# EasyEDA schematic SCH_Single-Sprayer_TH_2025-12-06.json
TITLE: Sheet_1; REV: 1.0; Date: 2025-02-28; Sheet: 1/1; Drawn By: rayjorgensen; Company: Your Company
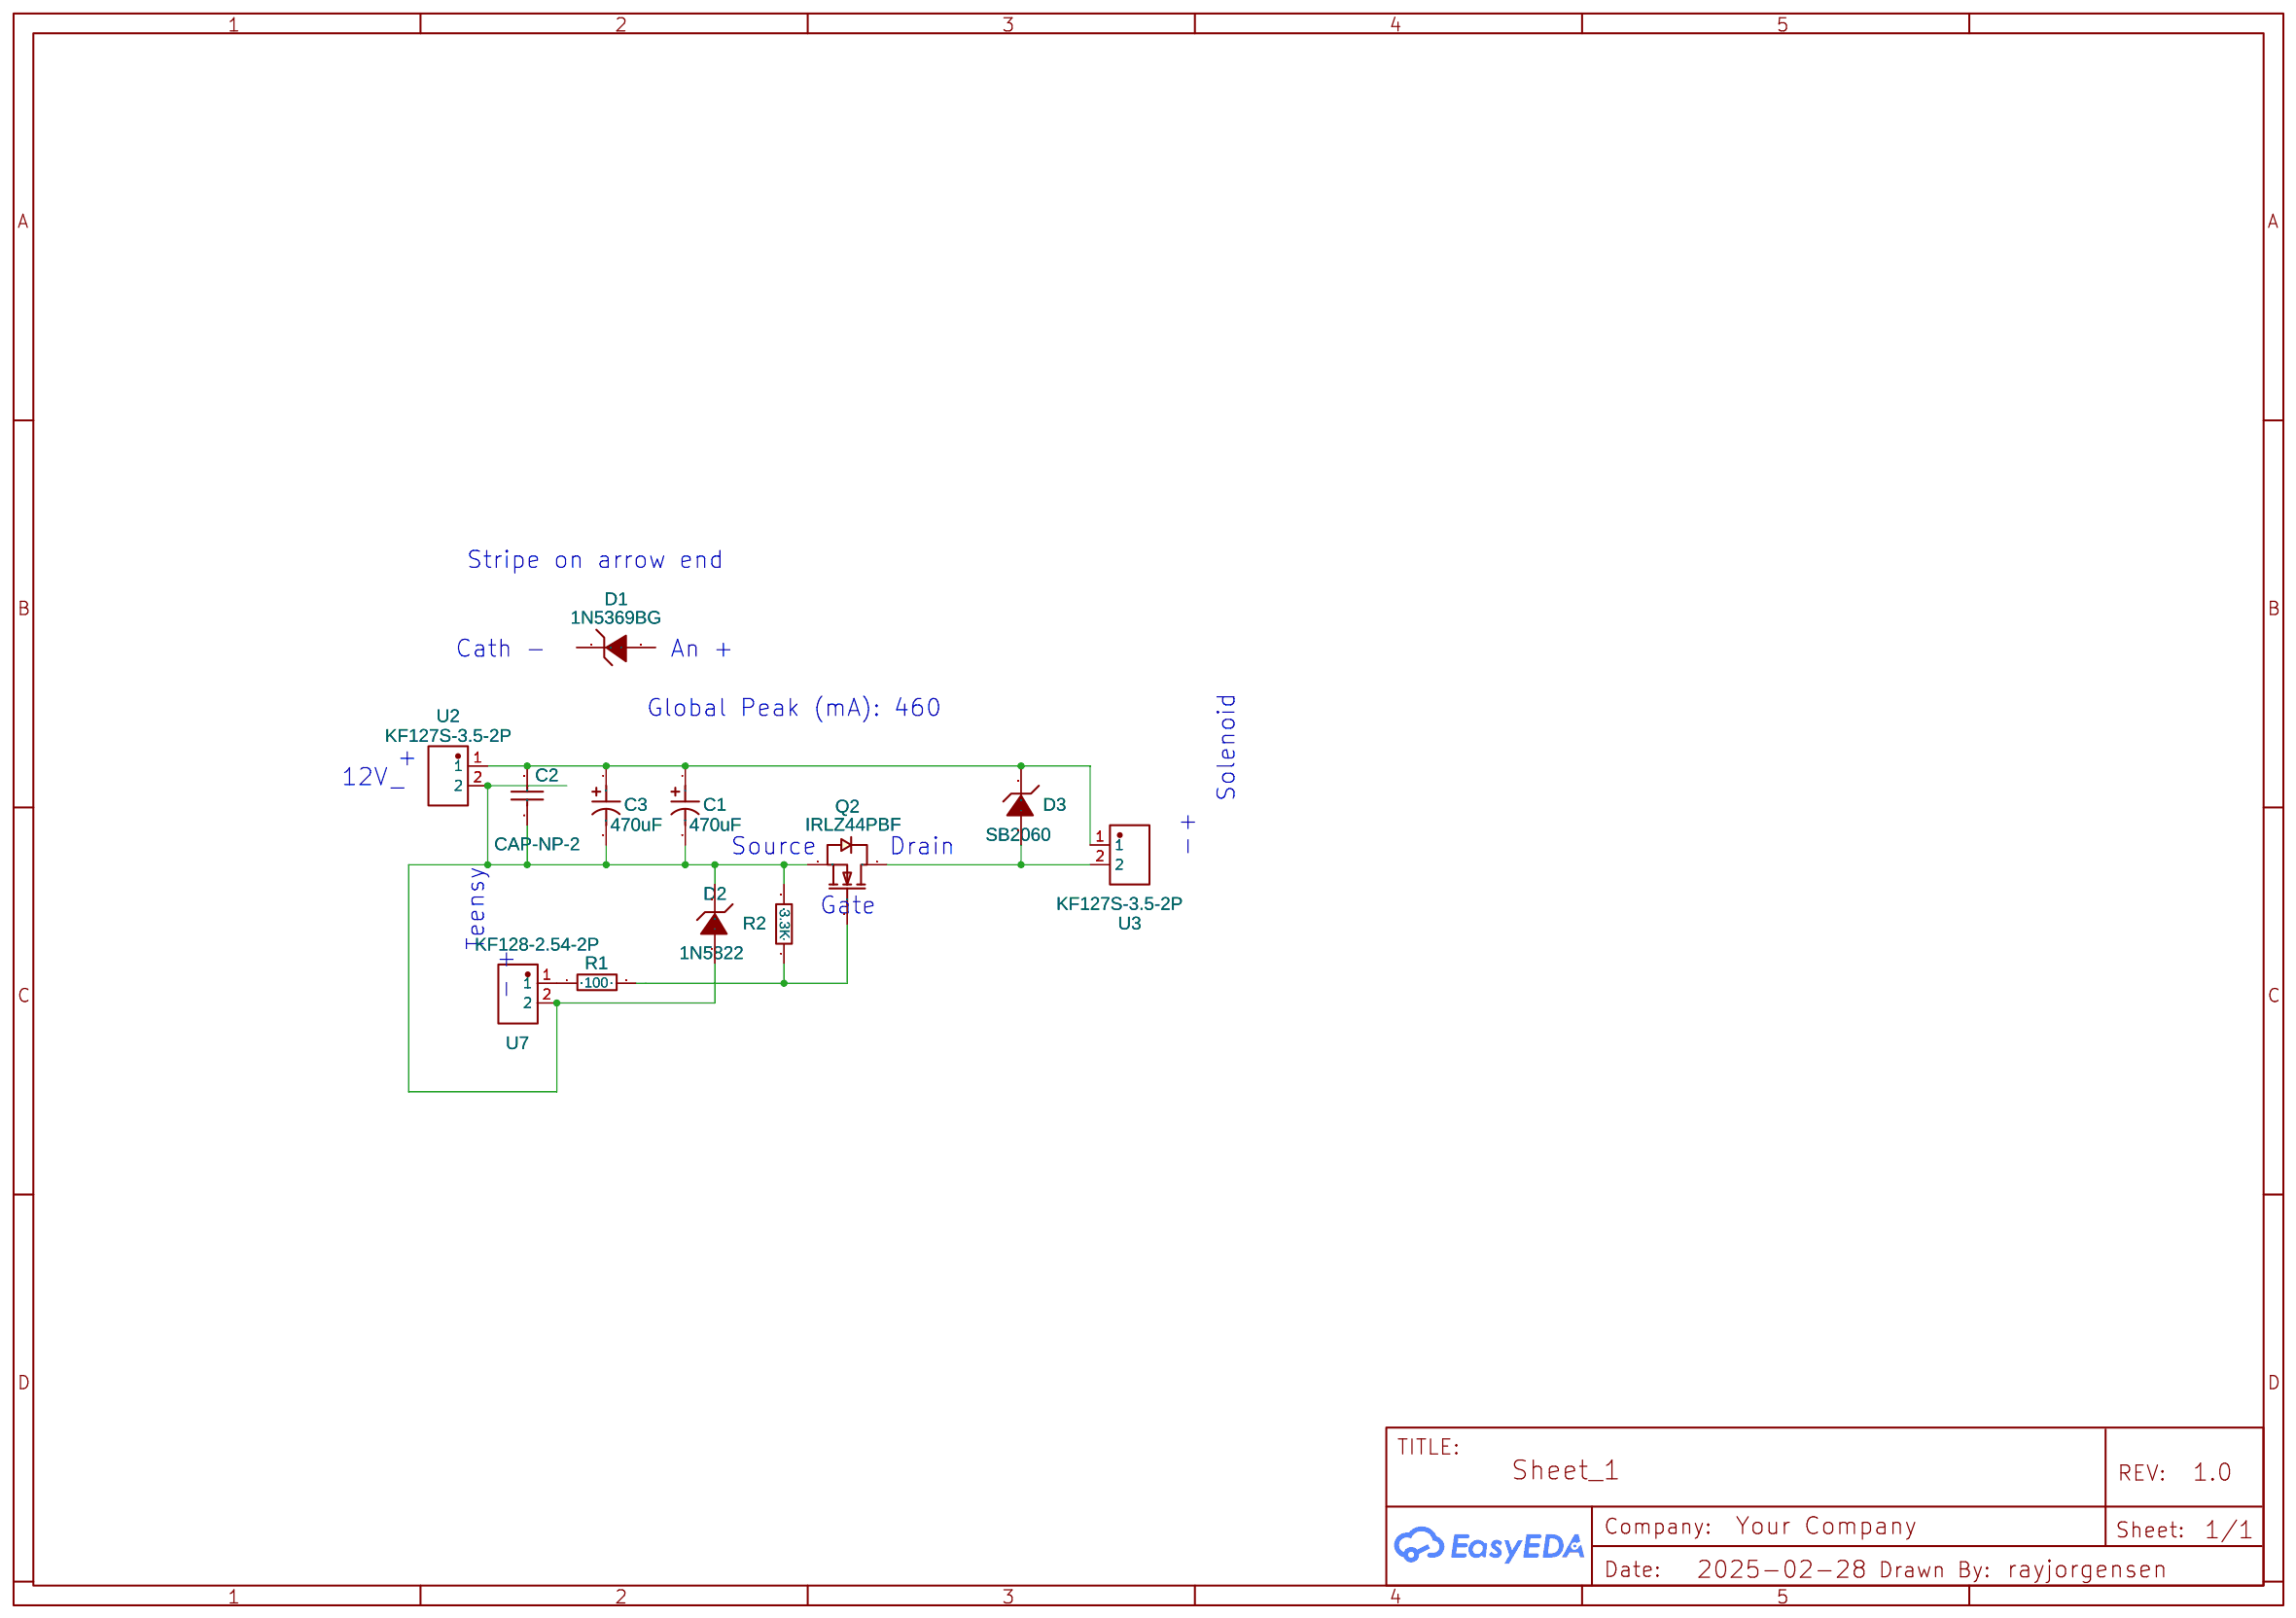
[diagram p0: schematic sheet]

## Parts
C1  470uF  [CAP-TH_BD12.5-P5.00-D0.8-FD]
C2  CAP-NP-2  [VISH-K104K15X7RF5TL2]
C3  470uF  [CAP-TH_BD12.5-P5.00-D0.8-FD]
D1  1N5369BG  [DO-14_BD3.6-L9.0-P12.00-D1.2-RD]
D2  1N5822  [DO-14_BD3.6-L9.0-P12.00-D1.2-RD]
D3  SB2060  [DO-14_BD3.6-L9.0-P12.00-D1.2-RD]
Q2  IRLZ44PBF  [TO-220-3_L10.0-W4.5-P2.54-L]
R1  100  [RES-TH_BD2.5-L6.5-P10.50-D0.6]
R2  3.3K  [RES-TH_BD2.5-L6.5-P10.50-D0.6]
U2  KF127S-3.5-2P  [CONN-TH_2P-P3.50_KEFA_KF127S-3.5-2P]
U3  KF127S-3.5-2P  [CONN-TH_2P-P3.50_KEFA_KF127S-3.5-2P]
U7  KF128-2.54-2P  [CONN-TH_P2.54_KF128-2.54-2P]

## Library data of the parts
C1 C3 = UHE1E102MHD6TO: Supplier: LCSC; Supplier Part: C1588747; Manufacturer: Nichicon(尼吉康); JLCPCB Part Class: Extended Part; Contributor: lcsc
C2 = CAP-NP-2: Size / Dimension: 0.157"Lx0.098"W(4.00mmx2.50mm); Manufacturer: Vishay; Operating Temperature: -55°C~125°C; Family: CeramicCapacitors; Other Names: BC1084CT; Catalog Drawings: Mono-KapSide2-15_5.58Mono-KapSide1_15; Manufacturer URL: http://www.vishay.com/; Standard Package: 1; Temperature Coefficient: X7R; Datasheet Version: 08/2013; Package Description: 2-Pin Through Hole Device, Body 4 x 2.6 mm; Mounting Type: ThroughHole; Lead Spacing: 0.098"(2.50mm); Tolerance: ±10%; Category: Capacitors; Mounting Technology: ThroughHole; Voltage - Rated: 50V; Lead Style: Straight; Online Catalog: Mono-Kap™Series; Datasheet URL: http://www.vishay.com/docs/45171/kseries.pdf; Applications: GeneralPurpose; Package / Case: Radial; Height - Seated (Max): 0.220"(5.58mm); Package Reference: K104K15X7RF5TL2; Series: Mono-Kap™K; Capacitance: 0.1µF; Packaging: CutTape(CT); Contributor: Mahmoud_511099
D1-D3 = 1N5369BG: Contributor: LCSC; Supplier: LCSC; Supplier Part: C232452; Manufacturer: onsemi(安森美); JLCPCB Part Class: Extended Part
Q2 = IRFZ44NPBF: Supplier: LCSC; Manufacturer: Infineon(英飞凌); Supplier Part: C2586; JLCPCB Part Class: Extended Part
R1 R2 = MFR0W4F6803A50: Supplier: LCSC; Manufacturer: UniOhm; Supplier Part: C58631; JLCPCB Part Class: Extended Part
U2 U3 = KF127S-3.5-2P: Contributor: lcsc; Supplier: LCSC; Supplier Part: C2974903; Manufacturer: KEFA(科发); JLCPCB Part Class: Extended Part
U7 = KF128-2.54-2P: Supplier: LCSC; Supplier Part: C474920; Manufacturer: Cixi Kefa Elec; Contributor: LCSC; JLCPCB Part Class: Extended Part

## Nets
Net-(C1-1): C1.1 C2.1 C3.1 D3.1(C) U2.1 U3.1
Net-(C1-2): C1.2 C2.2 C3.2 D2.1(C) D2.2(A) Q2.3(S) R2.2 U2.2 U7.2
Net-(D3-2): D3.2(A) Q2.2(D) U3.2
Net-(Q2-1): Q2.1(G) R1.2 R2.1
Net-(R1-1): R1.1 U7.1

Not connected (* = marked no-connect by the designer): D1 1(C) 2(A)

## Notes on the sheet
- Stripe on arrow end
- Cath -
- An +
- Global Peak (mA): 460
- +
- 12V
- -
- Solenoid
- Source
- Drain
- +
- -
- Gate
- Teensy
- +
- -
